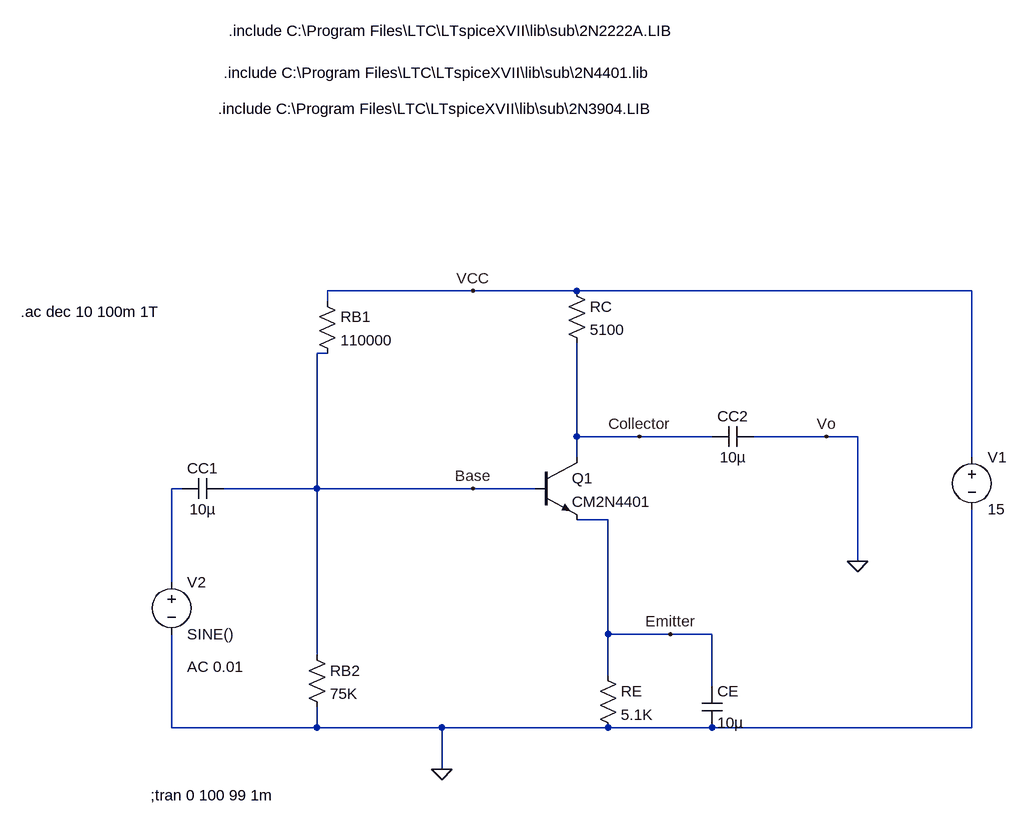
[diagram p0: schematic mp2 task2 c).asc]
mp2 task2 c).asc, the LTspice schematic file:
Version 4
SHEET 1 3216 804
WIRE 288 -16 64 -16
WIRE 448 -16 288 -16
WIRE 1056 -16 448 -16
WIRE 64 0 64 -16
WIRE 64 80 48 80
WIRE 448 208 448 64
WIRE 544 208 448 208
WIRE 656 208 544 208
WIRE 832 208 720 208
WIRE 880 208 832 208
WIRE 448 240 448 208
WIRE 1056 240 1056 -16
WIRE -160 288 -176 288
WIRE 48 288 48 80
WIRE 48 288 -96 288
WIRE 288 288 48 288
WIRE 384 288 288 288
WIRE 496 336 448 336
WIRE 880 400 880 208
WIRE -176 432 -176 288
WIRE 496 512 496 336
WIRE 592 512 496 512
WIRE 656 512 592 512
WIRE 48 544 48 288
WIRE 496 576 496 512
WIRE 656 592 656 512
WIRE -176 656 -176 512
WIRE 48 656 48 624
WIRE 48 656 -176 656
WIRE 240 656 48 656
WIRE 496 656 240 656
WIRE 656 656 496 656
WIRE 1056 656 1056 320
WIRE 1056 656 656 656
WIRE 240 720 240 656
FLAG 240 720 0
FLAG 288 -16 VCC
FLAG 592 512 Emitter
FLAG 880 400 0
FLAG 544 208 Collector
FLAG 288 288 Base
FLAG 832 208 Vo
SYMBOL res 48 -16 R0
SYMATTR InstName RB1
SYMATTR Value 110000
SYMBOL res 432 -32 R0
SYMATTR InstName RC
SYMATTR Value 5100
SYMBOL res 32 528 R0
SYMATTR InstName RB2
SYMATTR Value 75K
SYMBOL npn 384 240 R0
SYMATTR InstName Q1
SYMATTR Value CM2N4401
SYMBOL res 480 560 R0
SYMATTR InstName RE
SYMATTR Value 5.1K
SYMBOL cap -96 272 R90
WINDOW 0 0 32 VBottom 2
WINDOW 3 32 32 VTop 2
SYMATTR InstName CC1
SYMATTR Value 10µ
SYMBOL cap 640 592 R0
SYMATTR InstName CE
SYMATTR Value 10µ
SYMBOL cap 720 192 R90
WINDOW 0 0 32 VBottom 2
WINDOW 3 32 32 VTop 2
SYMATTR InstName CC2
SYMATTR Value 10µ
SYMBOL voltage 1056 224 R0
WINDOW 123 0 0 Left 0
WINDOW 39 0 0 Left 0
SYMATTR InstName V1
SYMATTR Value 15
SYMBOL voltage -176 416 R0
WINDOW 123 24 146 Left 2
WINDOW 39 0 0 Left 0
SYMATTR Value2 AC 0.01
SYMATTR InstName V2
SYMATTR Value SINE()
TEXT -104 -296 Left 2 !.include C:\\Program Files\\LTC\\LTspiceXVII\\lib\\sub\\2N3904.LIB
TEXT -96 -352 Left 2 !.include C:\\Program Files\\LTC\\LTspiceXVII\\lib\\sub\\2N4401.lib
TEXT -88 -416 Left 2 !.include C:\\Program Files\\LTC\\LTspiceXVII\\lib\\sub\\2N2222A.LIB
TEXT -208 760 Left 2 !;tran 0 100 99 1m
TEXT -408 16 Left 2 !.ac dec 10 100m 1T

The netlist it stands for:
* mp2 task2 c).asc
RB1 VCC Base 110000
RC VCC Collector 5100
RB2 Base 0 75K
Q1 Collector Base Emitter 0 CM2N4401
RE Emitter 0 5.1K
CC1 Base N001 10µ
CE Emitter 0 10µ
CC2 0 Collector 10µ
V1 VCC 0 15
V2 N001 0 SINE() AC 0.01
.model NPN NPN
.model PNP PNP
.lib standard.bjt
.include C:\Program Files\LTC\LTspiceXVII\lib\sub\2N3904.LIB
.include C:\Program Files\LTC\LTspiceXVII\lib\sub\2N4401.lib
.include C:\Program Files\LTC\LTspiceXVII\lib\sub\2N2222A.LIB
;tran 0 100 99 1m
.ac dec 10 100m 1T
.backanno
.end

* Results of the author's LTspice run, read from the files saved beside the schematic
* Operating Point, zero values left out:
*   V(vcc) = 15 V
*   V(base) = 5.778 V
*   V(collector) = 9.915 V
*   V(emitter) = 5.12 V
*   Ic(Q1) = 997.1 µA
*   Ib(Q1) = 6.803 µA
*   Ie(Q1) = -1.004 mA
*   I(Re) = 1.004 mA
*   I(Rb2) = 77.04 µA
*   I(Rc) = 997.1 µA
*   I(Rb1) = 83.84 µA
*   I(V1) = -1.081 mA
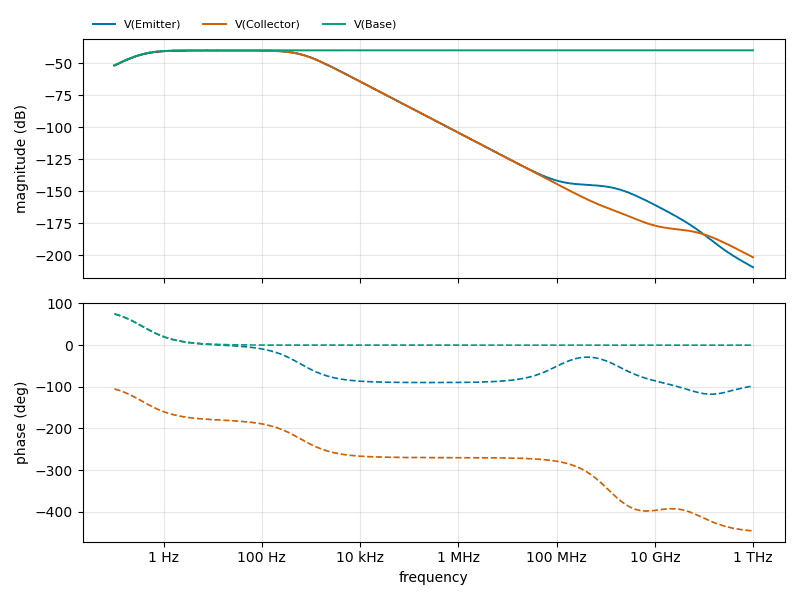
[diagram p1: AC Analysis of mp2 task2 c).asc, plotted from the saved traces]
* AC Analysis, 1 run:
*   V(Emitter): -51.81 dB at 100 mHz, -209.36 dB at 1 THz, peak -40.10 dB at 15.85 Hz, 3 dB below the peak at 373.6 mHz and 613.1 Hz
*   V(Collector): -51.86 dB at 100 mHz, -201.58 dB at 1 THz, peak -40.14 dB at 15.85 Hz, 3 dB below the peak at 374 mHz and 613.2 Hz
*   V(Base): -51.76 dB at 100 mHz, -40.00 dB at 1 THz, peak -40.00 dB at 1 THz, 3 dB below the peak at 377.7 mHz